# Altium schematic sheet Nano Screw Terminal Adapter.SchDoc: Nano Screw Terminal Adapter
size A4; VersionControl_RevNumber: V 0.2; DocumentNumber: ASX00037; SheetNumber: 1; SheetTotal: 1; RevAuthor: Giuseppe Pinto
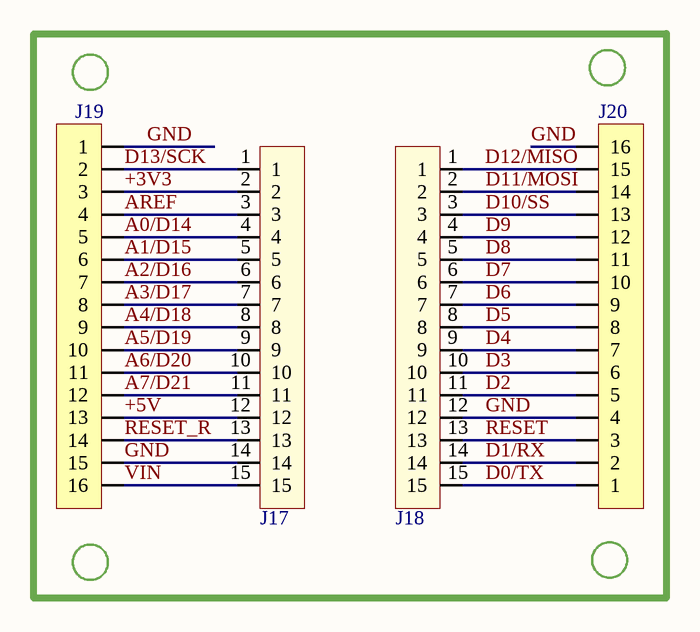
[diagram p0: Nano Screw Terminal Adapter.SchDoc]

## Parts
J17  HLE-115-02-F-DV  [HLE-115-02-F-DV-Footprint-1]  (value not drawn)
J18  HLE-115-02-F-DV  [HLE-115-02-F-DV-Footprint-1]  (value not drawn)
J19  22TW-277  [MK125002GO]  (value not drawn)
J20  22TW-277  [MK125002GO]  (value not drawn)

## Nets
+3V3: J17.2 J19.3
+5V: J17.12 J19.13
A0/D14: J17.4 J19.5
A1/D15: J17.5 J19.6
A2/D16: J17.6 J19.7
A3/D17: J17.7 J19.8
A4/D18: J17.8 J19.9
A5/D19: J17.9 J19.10
A6/D20: J17.10 J19.11
A7/D21: J17.11 J19.12
AREF: J17.3 J19.4
D0/TX: J18.15 J20.1
D1/RX: J18.14 J20.2
D2: J18.11 J20.5
D3: J18.10 J20.6
D4: J18.9 J20.7
D5: J18.8 J20.8
D6: J18.7 J20.9
D7: J18.6 J20.10
D8: J18.5 J20.11
D9: J18.4 J20.12
D10/SS: J18.3 J20.13
D11/MOSI: J18.2 J20.14
D12/MISO: J18.1 J20.15
D13/SCK: J17.1 J19.2
GND: J17.14 J18.12 J19.1 J19.15 J20.4 J20.16
RESET: J18.13 J20.3
RESET_R: J17.13 J19.14
VIN: J17.15 J19.16

## Notes on the sheet
- Title:
- ID:
- Date:
- Time:
- Revision:
- Sheet
- of
- RevAuthor:
- Reference Designs ARE PROVIDED "AS IS" AND "WITH ALL FAULTS. Arduino SA DISCLAIMS ALL OTHER WARRANTIES, EXPRESS OR IMPLIED, REGARDING PRODUCTS, INCLUDING BUT NOT LIMITED TO, ANY IMPLIED WARRANTIES OF MERCHANTABILITY OR FITNESS FOR A PARTICULAR PURPOSE.
  Arduino SA may make changes to specifications and product descriptions at any time, without notice. The Customer must not rely on the absence or characteristics of any features or instructions marked "reserved" or "undefined". Arduino SA reserves these for future definition and shall have no responsibility whatsoever for conflicts or incompatibilities arising from future changes to them. The product information on the Web Site or Materials is subject to change without notice.
  Do not finalize a design with this info. ARDUINO and other Arduino brands and logos and Trademarks of Arduino SA. All Arduino SA Trademarks cannot be used without owner's formal permission.
- File:
- Author:

## Library data of the parts
J17 J18 = J0233-A.13: Board Connector, 30 Contact(s), 2 Row(s), Female, Straight, Surface Mount Terminal, Socket GPinto; Manufacturer: Samtec; Number of Contacts: 30; Code Arduino: J0233; Mount: Board; Connector Type: BOARD CONNECTOR; Contact Material: Copper; Termination: SMD/SMT; REACH SVHC: Yes; Part Number: HLE-115-02-F-DV
J19 J20 = J0275-A.6: CONN MORS.CS 16v p3,5 10A aLING.VER BLACK; Manufacturer: 4U CON; Code Arduino: J0275; Number of Contacts: 16; Pin Count: 16; Number of Conductors: 16; Max Current Rating: 10A; Part Number: 22TW-277